# Altium project 2 outputs 3 inputs.PrjPcb
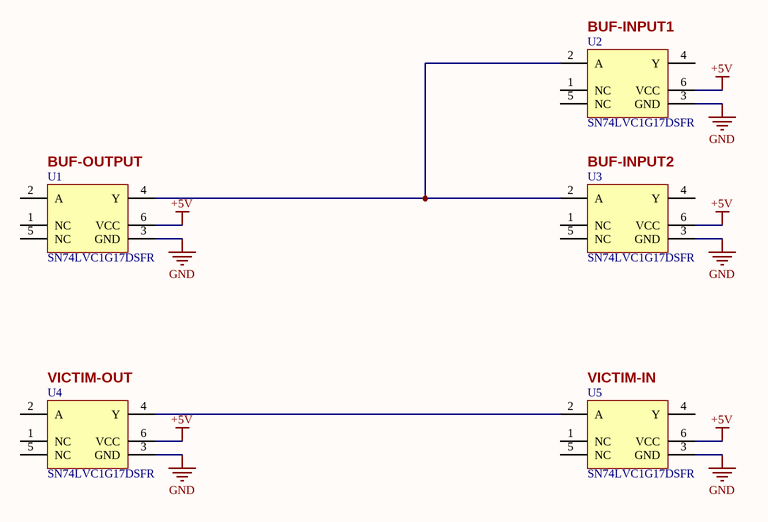
[diagram p0: Schematic.SchDoc]
1 sheet, 5 parts. Net scope: global (net labels, ports and power ports of the same name join across sheets).
Board file: PCB.PcbDoc

## Sheet Schematic.SchDoc
size A; SheetNumber: 1; SheetTotal: 1

### Parts
U1  SN74LVC1G17DSFR  [DSF0006A_V]
U2  SN74LVC1G17DSFR  [DSF0006A_V]
U3  SN74LVC1G17DSFR  [DSF0006A_V]
U4  SN74LVC1G17DSFR  [DSF0006A_V]
U5  SN74LVC1G17DSFR  [DSF0006A_V]

### Nets
+5V: U1.6(VCC) U2.6(VCC) U3.6(VCC) U4.6(VCC) U5.6(VCC)
GND: U1.3(GND) U2.3(GND) U3.3(GND) U4.3(GND) U5.3(GND)
NetU1_4: U1.4(Y) U2.2(A) U3.2(A)
NetU4_4: U4.4(Y) U5.2(A)

Not connected (* = marked no-connect by the designer): U1 1(NC) 2(A) 5(NC); U2 1(NC) 4(Y) 5(NC); U3 1(NC) 4(Y) 5(NC); U4 1(NC) 2(A) 5(NC); U5 1(NC) 4(Y) 5(NC)

### Notes on the sheet
- (near U2) BUF-INPUT1
- (near U1) BUF-OUTPUT
- (near U3) BUF-INPUT2
- (near U4) VICTIM-OUT
- (near U5) VICTIM-IN

### Library data of the parts
U1-U5 = SN74LVC1G17DSFR: Buffer, LVC/LCX/Z Series, 1-Func, 1-Input, CMOS, PDSO6; Manufacturer: Texas Instruments; Package Body Material: Plastic; Load Capacitance (CL): 50pF; Load/Preset Input: Yes; Max I(ol): 24mA; Number of Functions: 1; Power Supplies: 3.3V; Prop. Delay@Nom-Sup: 5.5ns; Propagation Delay (tpd): 11ns; Supply Voltage-Max (Vsup): 5.5V; Supply Voltage-Min (Vsup): 1.65V; Qualification Status: Not Qualified; Supplier 1: Digi-Key; Manufacturer Part Number: SN74LVC1G17DSFR; RoHS: Yes; Category: Buffers, Drivers and Transceivers; Stock 1: 8464; Pricing 1: 1=0.40000, 10=0.32400, 25=0.29640, 100=0.22050, 250=0.19980, 500=0.16536, 1000=0.12402, 2500=0.11368 (USD); Package Code: VSON; Number of Pins: 6; Package Shape: Square; Terminal Finish: Nickel; Min Operating Temperature: -40°C; Max Operating Temperature: 125°C; JESD-609 Code: e4; JESD-30 Code: S-PDSO-N6; Logic IC Type: BUFFER; Moisture Sensitivity Level: 1; Number of Inputs: 1; Package Style: SMALL OUTLINE, VERY THIN PROFILEMeter; Packaging: Tape and Reel; Peak Reflow Temperature (Cel): 260°C; Schmitt Trigger: Yes; Supply Voltage-Nom (Vsup): 3.3V; Surface Mount: Yes; Technology: CMOS; Terminal Form: No Lead; Terminal Position: DUAL; Length: 1mm; Width: 1mm; Height - Seated (Max): 0.4mm; Terminal Pitch: 0.35mm; Temperature Grade: AUTOMOTIVE; REACH SVHC: Yes; RoHS Compliant: Yes; ComponentLink1URL: https://www.ti.com:443/lit/ds/symlink/sn74lvc1g17.pdf?src-supplier=IHS+Markit; ComponentLink1Description: https://www.ti.com:443/lit/ds/symlink/sn74lvc1g17.pdf?src-supplier=IHS+Markit; ComponentLink2URL: https://datasheet.ciiva.com/14302/sn74lvc1g17-14302021.pdf?src-supplier=Avnet; ComponentLink2Description: https://datasheet.ciiva.com/14302/sn74lvc1g17-14302021.pdf?src-supplier=Avnet; ComponentLink3URL: https://datasheet.ciiva.com/1833/sn74lvc1g17-1833721.pdf?src-supplier=Digi-Key; ComponentLink3Description: https://datasheet.ciiva.com/1833/sn74lvc1g17-1833721.pdf?src-supplier=Digi-Key; ComponentLink4URL: https://datasheet.ciiva.com/1833/sn74lvc1g17-1833722.pdf?src-supplier=Digi-Key; ComponentLink4Description: https://datasheet.ciiva.com/1833/sn74lvc1g17-1833722.pdf?src-supplier=Digi-Key; ComponentLink5URL: https://datasheet.ciiva.com/26220/sn74lvc1g17-26220778.pdf?src-supplier=Avnet+Europe; ComponentLink5Description: https://datasheet.ciiva.com/26220/sn74lvc1g17-26220778.pdf?src-supplier=Avnet+Europe; ComponentLink6URL: https://datasheet.ciiva.com/1833/sn74lvc1g17-1833723.pdf?src-supplier=Digi-Key; ComponentLink6Description: https://datasheet.ciiva.com/1833/sn74lvc1g17-1833723.pdf?src-supplier=Digi-Key; ComponentLink7URL: https://datasheet.ciiva.com/48703/001074211-da-01-en-ic-buffer-schm-sn74lvc1g17dsfr-son-6-tid-48703259.pdf?src-supplier=Conrad; ComponentLink7Description: https://datasheet.ciiva.com/48703/001074211-da-01-en-ic-buffer-schm-sn74lvc1g17dsfr-son-6-tid-48703259.pdf?src-supplier=Conrad; Supplier Part Number 1: 296-29050-1-ND